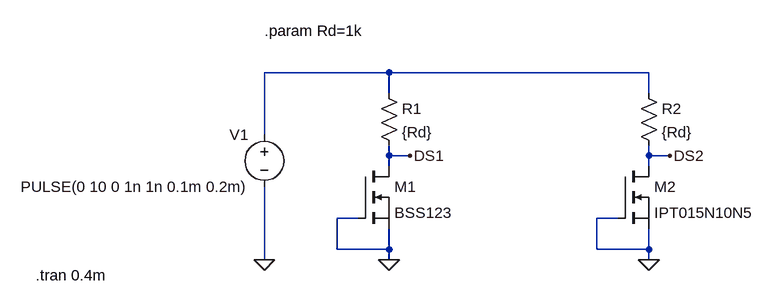
[diagram p0: schematic mosfet-capacity.asc]
mosfet-capacity.asc, the LTspice schematic file:
Version 4
SHEET 1 880 680
WIRE 96 -16 -96 -16
WIRE 496 -16 96 -16
WIRE 96 16 96 -16
WIRE 496 16 496 -16
WIRE -96 80 -96 -16
WIRE 96 112 96 96
WIRE 128 112 96 112
WIRE 496 112 496 96
WIRE 528 112 496 112
WIRE 96 128 96 112
WIRE 496 128 496 112
WIRE 48 208 16 208
WIRE 448 208 416 208
WIRE 16 256 16 208
WIRE 96 256 96 224
WIRE 96 256 16 256
WIRE 416 256 416 208
WIRE 496 256 496 224
WIRE 496 256 416 256
WIRE -96 272 -96 160
WIRE 96 272 96 256
WIRE 496 272 496 256
FLAG 96 272 0
FLAG 496 272 0
FLAG 128 112 DS1
FLAG 528 112 DS2
FLAG -96 272 0
SYMBOL nmos 48 128 R0
SYMATTR InstName M1
SYMATTR Value BSS123
SYMBOL nmos 448 128 R0
SYMATTR InstName M2
SYMATTR Value IPT015N10N5
SYMBOL res 80 0 R0
SYMATTR InstName R1
SYMATTR Value {Rd}
SYMBOL res 480 0 R0
SYMATTR InstName R2
SYMATTR Value {Rd}
SYMBOL voltage -96 64 M0
WINDOW 123 0 0 Left 0
WINDOW 39 0 0 Left 0
SYMATTR InstName V1
SYMATTR Value PULSE(0 10 0 1n 1n 0.1m 0.2m)
TEXT -448 296 Left 2 !.tran 0.4m
TEXT -96 -80 Left 2 !.param Rd=1k

The netlist it stands for:
* mosfet-capacity.asc
M1 DS1 0 0 0 BSS123
M2 DS2 0 0 0 IPT015N10N5
R1 N001 DS1 {Rd}
R2 N001 DS2 {Rd}
V1 N001 0 PULSE(0 10 0 1n 1n 0.1m 0.2m)
.model NMOS NMOS
.model PMOS PMOS
.lib standard.mos
.tran 0.4m
.param Rd=1k
.backanno
.end